# Altium schematic sheet Top_Level.SchDoc
size A; SheetNumber: 2; SheetTotal: 5
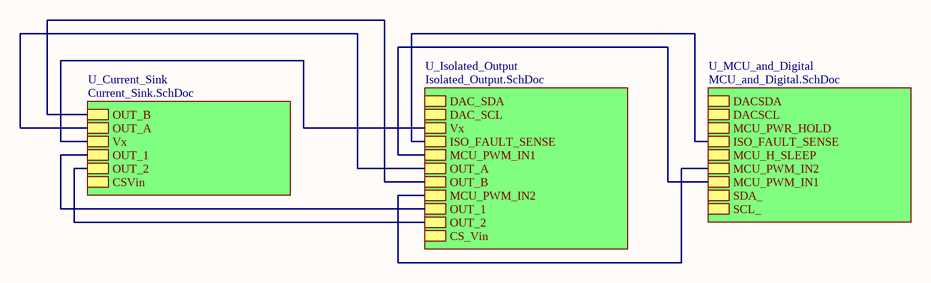
[diagram p0: Top_Level.SchDoc]

## Sub-sheets
U_Current_Sink = Current_Sink.SchDoc: OUT_B, OUT_A, Vx, OUT_1, OUT_2, CSVin
U_Isolated_Output = Isolated_Output.SchDoc: DAC_SDA, DAC_SCL, Vx, ISO_FAULT_SENSE, MCU_PWM_IN1, OUT_A, OUT_B, MCU_PWM_IN2, OUT_1, OUT_2, CS_Vin
U_MCU_and_Digital = MCU_and_Digital.SchDoc: DACSDA, DACSCL, MCU_PWR_HOLD, ISO_FAULT_SENSE, MCU_H_SLEEP, MCU_PWM_IN2, MCU_PWM_IN1, SDA_, SCL_

## Nets
(unnamed): sheet U_Current_Sink/OUT_B, sheet U_Isolated_Output/OUT_B
(unnamed): sheet U_Current_Sink/OUT_A, sheet U_Isolated_Output/OUT_A
(unnamed): sheet U_Current_Sink/Vx, sheet U_Isolated_Output/Vx
(unnamed): sheet U_Current_Sink/OUT_1, sheet U_Isolated_Output/OUT_1
(unnamed): sheet U_Current_Sink/OUT_2, sheet U_Isolated_Output/OUT_2
(unnamed): sheet U_Isolated_Output/ISO_FAULT_SENSE, sheet U_MCU_and_Digital/ISO_FAULT_SENSE
(unnamed): sheet U_Isolated_Output/MCU_PWM_IN1, sheet U_MCU_and_Digital/MCU_PWM_IN1
(unnamed): sheet U_Isolated_Output/MCU_PWM_IN2, sheet U_MCU_and_Digital/MCU_PWM_IN2